# EAGLE design testx2 (EAGLE 7.6.0)

## Sheet 1 of 2
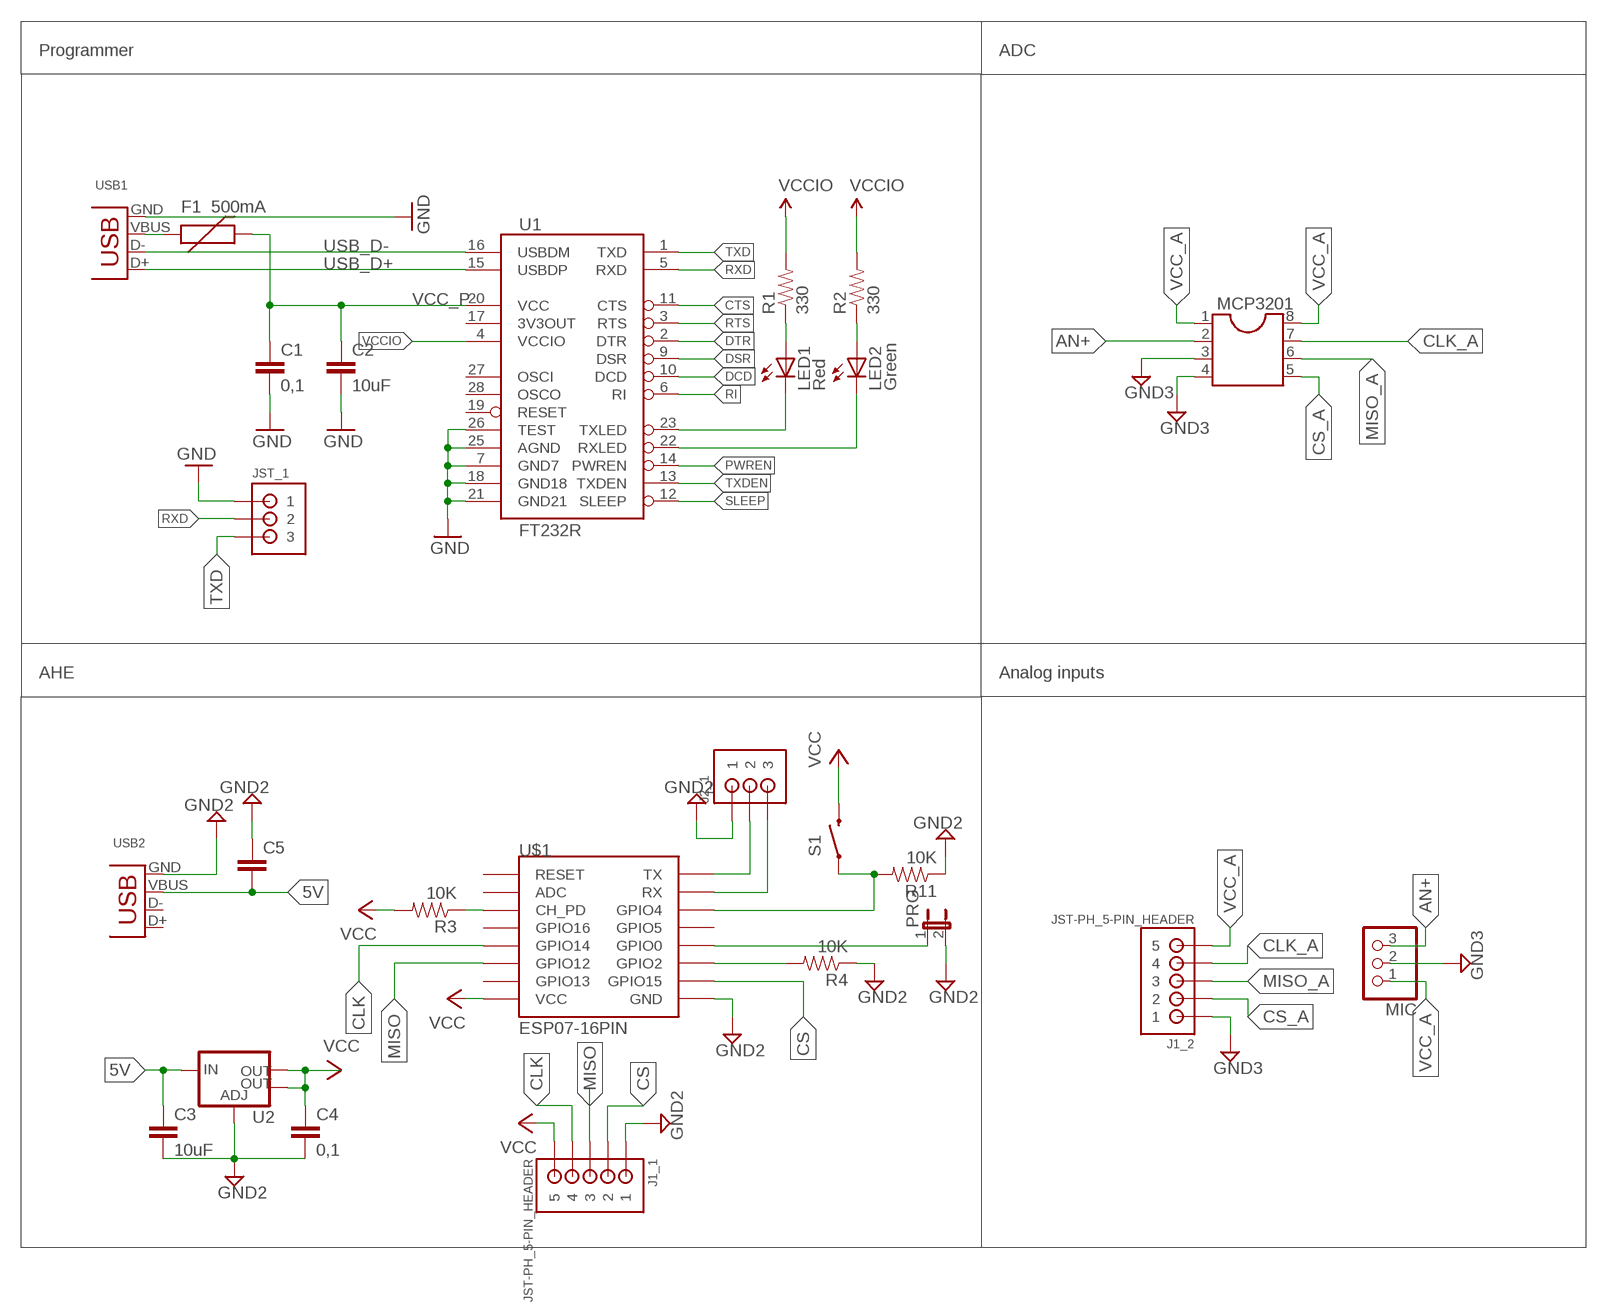
[diagram p0: schematic, sheet 1]

### Parts
C1  0,1  10UF10V10%(0805)  [0805-CAP]
C2  10uF  10UF10V10%(0805)  [0805-CAP]
C3  10uF  10UF10V10%(0805)  [0805-CAP]
C4  0,1  10UF10V10%(0805)  [0805-CAP]
C5  CAP_  [AXIAL-5MM]
F1  500mA  PTCSMD  [PTC-1206]
J1_1  JST-PH_5-PIN_HEADER  [JST_B5B-PH_HEADER]
J1_2  JST-PH_5-PIN_HEADER  [JST_B5B-PH_HEADER]
J2_1  JST-PH_3-PIN_HEADER  [JST_B3B-PH_HEADER]
JST_1  JST-PH_3-PIN_HEADER  [JST_B3B-PH_HEADER]
LED1  Red  LEDSML0805  [SML0805]
LED2  Green  LEDSML0805  [SML0805]
MCP3201  DIL8  [DIL08]
MIC  PINHD-1X03_2.54-S  [1X03-S]
PRG  JP1E  [JP1]
R1  330  0.22OHM-1/4W-1%(0805)  [0805]
R2  330  0.22OHM-1/4W-1%(0805)  [0805]
R3  10K  0.22OHM-1/4W-1%(0805)  [0805]
R4  10K  0.22OHM-1/4W-1%(0805)  [0805]
R11  10K  0.22OHM-1/4W-1%(0805)  [0805]
S1  SWITCH-MOMENTARY-2PTH  [TACTILE-PTH]
U1  FT232R  FT232RLSSOP  [SSOP28DB]
U2  V_REG_LM1117SOT223  [SOT223]
U$1  ESP07-16PIN  [ESP07-16PIN]
USB1  USB-MB-S  [USB-MB-S]
USB2  USB-MB-S  [USB-MB-S]

### Nets
5V: C3.1 C5.P$2 U2.3(IN) USB2.VBUS
AN+: MCP3201.2 MIC.3
CLK: J1_1.P4 U$1.GPIO14
CLK_A: J1_2.P4 MCP3201.7
CS: J1_1.P2 U$1.GPIO15
CS_A: J1_2.P2 MCP3201.5
CTS: U1.11(CTS)
DCD: U1.10(DCD)
DSR: U1.9(DSR)
DTR: U1.2(DTR)
GND [power]: C1.2 C2.2 JST_1.P1 U1.7(GND7) U1.18(GND18) U1.21(GND21) U1.25(AGND) U1.26(TEST) USB1.GND
GND2 [power]: C3.2 C4.2 C5.P$1 J1_1.P1 J2_1.P1 PRG.2 R4.1 R11.1 U2.1(ADJ) U$1.GND USB2.GND
GND3: J1_2.P1 MCP3201.3 MCP3201.4 MIC.2
MISO: J1_1.P3 U$1.GPIO12
MISO_A: J1_2.P3 MCP3201.6
N$1: LED1.A R1.1
N$2: LED2.A R2.1
N$3: F1.1 USB1.VBUS
N$4: R3.1 U$1.CH_PD
N$5: J2_1.P2 U$1.TX
N$6: R4.2 U$1.GPIO2
N$7: PRG.1 U$1.GPIO0
N$8: J2_1.P3 U$1.RX
N$16: R11.2 S1.1 U$1.GPIO4
PWREN: U1.14(PWREN)
RI: U1.6(RI)
RTS: U1.3(RTS)
RXD: JST_1.P2 U1.5(RXD)
RXLED: LED2.C U1.22(RXLED)
SLEEP: U1.12(SLEEP)
TXD: JST_1.P3 U1.1(TXD)
TXDEN: U1.13(TXDEN)
TXLED: LED1.C U1.23(TXLED)
USB_D+: U1.15(USBDP) USB1.D+
USB_D-: U1.16(USBDM) USB1.D-
VCC [power]: C4.1 J1_1.P5 R3.2 S1.3 U2.2(OUT) U2.4(OUT) U$1.VCC
VCC_A [power]: J1_2.P5 MCP3201.1 MCP3201.8 MIC.1
VCC_P [power]: C1.1 C2.1 F1.2 U1.20(VCC)
VCCIO: R1.2 R2.2 U1.4(VCCIO)
Unconnected: U1.17(3V3OUT) U1.19(RESET) U1.27(OSCI) U1.28(OSCO) U$1.ADC U$1.GPIO5 U$1.GPIO13 U$1.GPIO16 U$1.REST(RESET) USB2.D+ USB2.D-

### Notes on the sheet
- Programmer | ADC
- AHE | Analog inputs

## Sheet 2 of 2
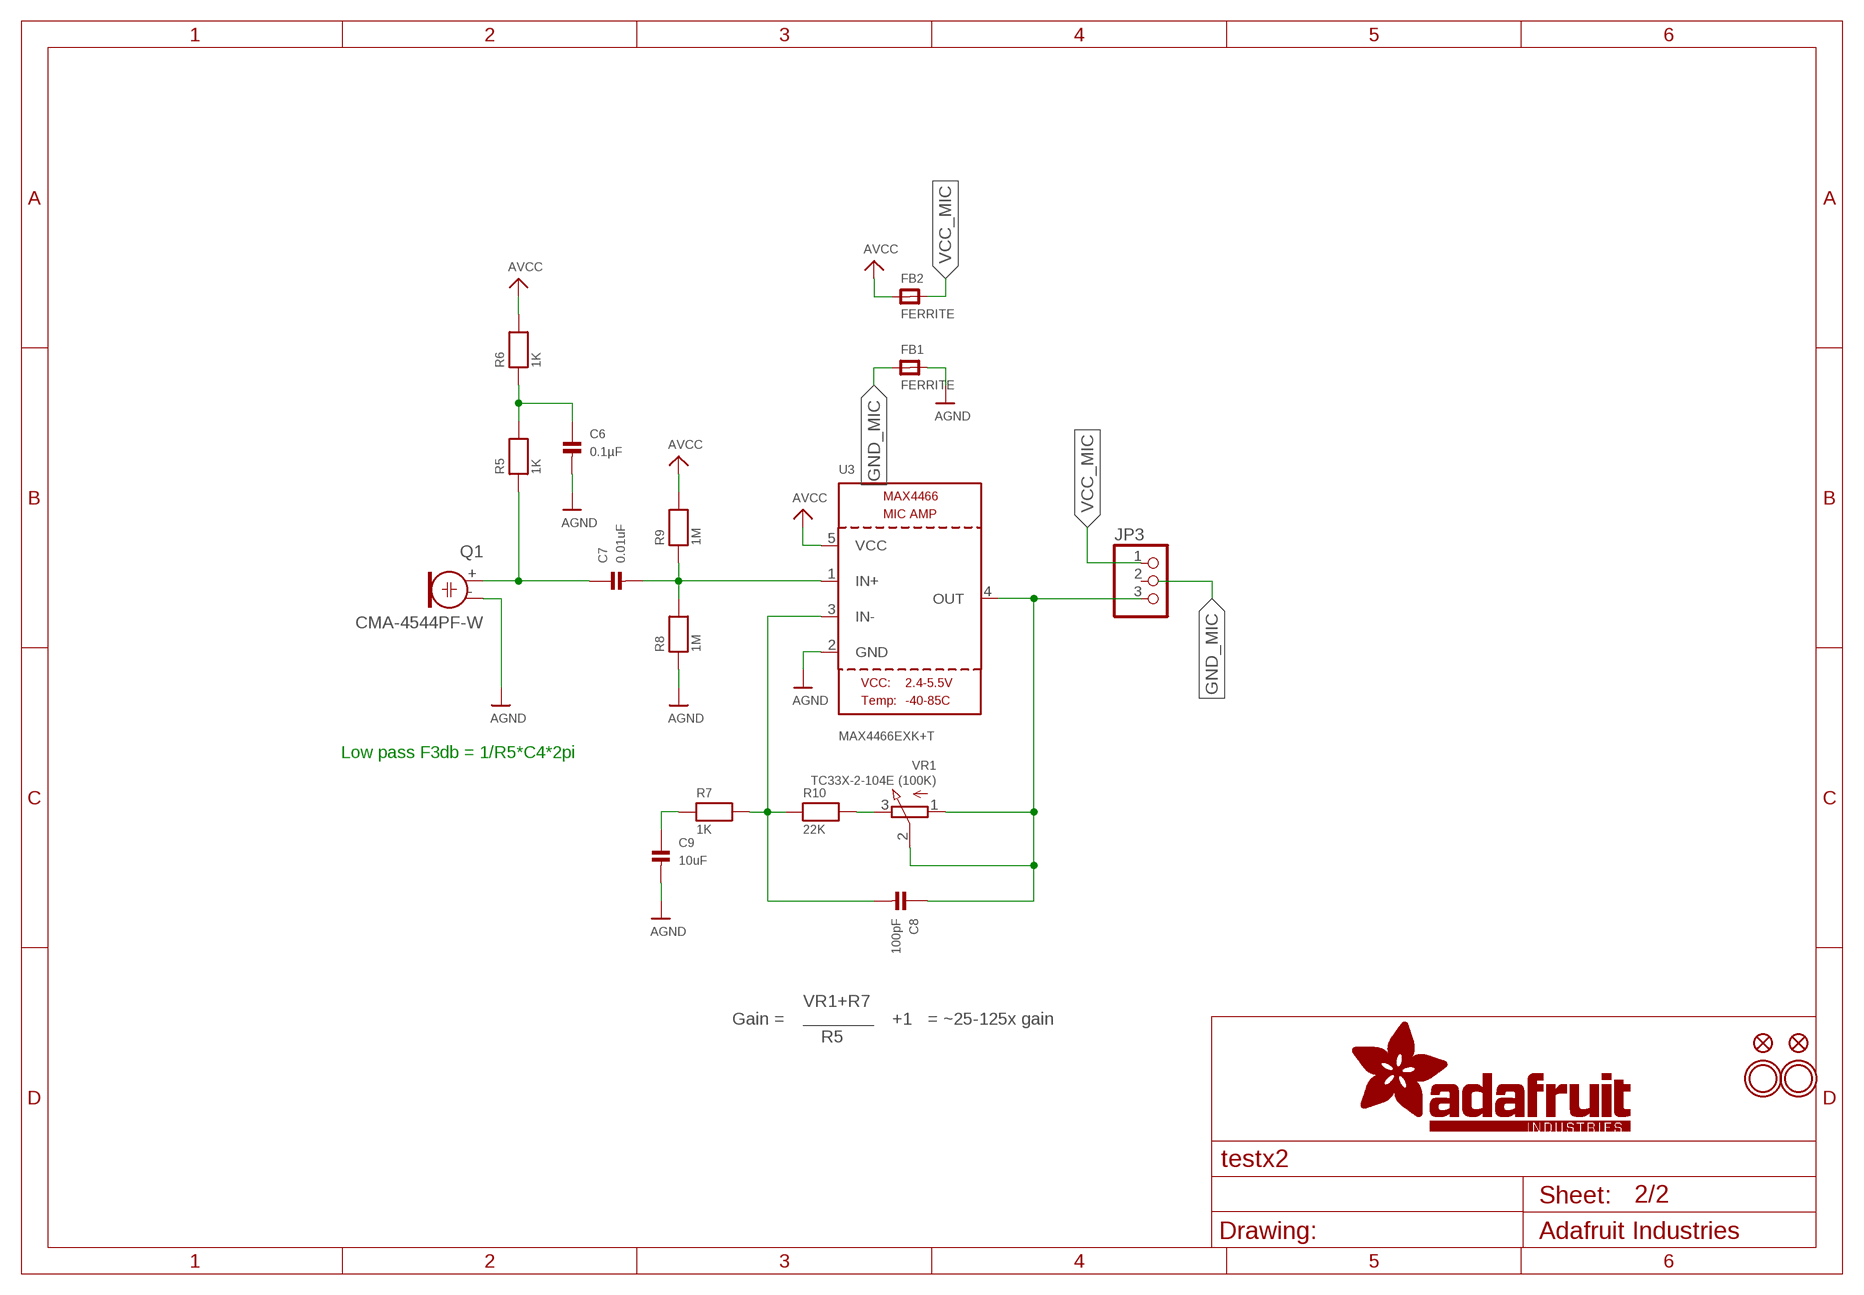
[diagram p1: schematic, sheet 2]

### Parts
C6  0.1µF  CAP_CERAMIC0805  [0805]
C7  0.01uF  CAP_CERAMIC0805  [0805]
C8  100pF  CAP_CERAMIC0805  [0805]
C9  10uF  CAP_CERAMIC0805  [0805]
FB1  FERRITE  FERRITE0805  [0805]
FB2  FERRITE  FERRITE0805  [0805]
FID1  FIDUCIAL""  [FIDUCIAL_1MM]
FID2  FIDUCIAL""  [FIDUCIAL_1MM]
JP3  HEADER-1X376MIL  [1X03_ROUND_76]
Q1  CMA-4544PF-W  ELECTRET  [ELECTRET_9.7]
R5  1K  RESISTOR0805  [0805]
R6  1K  RESISTOR0805  [0805]
R7  1K  RESISTOR0805  [0805]
R8  1M  RESISTOR0805  [0805]
R9  1M  RESISTOR0805  [0805]
R10  22K  RESISTOR0805  [0805]
U3  MAX4466EXK+T  MAX4466""  [SC70-5]
U$16  MOUNTINGHOLE2.5  [MOUNTINGHOLE_2.5_PLATED]
U$17  MOUNTINGHOLE2.5  [MOUNTINGHOLE_2.5_PLATED]
VR1  TC33X-2-104E (100K)  TRIMPOTTC33X-2  [TRIMPOT_BOURNS_TC33X-2]

### Nets
AGND: C6.2 C9.2 FB1.2 Q1.- R8.1 U3.2(GND)
AVCC: FB2.1 R6.2 R9.2 U3.5(VCC)
GND_MIC: FB1.1
N$9: C7.1 Q1.+ R5.1
N$10: C6.1 R5.2 R6.1
N$11: C7.2 R8.2 R9.1 U3.1(IN+)
N$12: C8.1 JP3.3 U3.4(OUT) VR1.1(A) VR1.2(S)
N$13: C8.2 R7.2 R10.1 U3.3(IN-)
N$14: C9.1 R7.1
N$15: R10.2 VR1.3(E)
VCC_MIC [power]: FB2.2 JP3.1
Unconnected: JP3.2

### Notes on the sheet
- Low pass F3db = 1/R5*C4*2pi
- VR1+R7
- Gain = | +1 | = ~25-125x gain
- R5

## Library data of the parts
C1-C4 = SparkFun-Capacitors:10UF10V10%(0805): CAP-11330; PROD_ID: CAP-11330
C5 = SparkFun-Capacitors:CAP: Capacitor Standard 0603 ceramic capacitor, and 0.1" leaded capacitor.
C6-C9 = microbuilder:CAP_CERAMIC: Ceramic Capacitors 0402 - 0402 Surface Mount Capacitors 16pF 50V 5% [Digikey: 445-4899-2-ND] 18pF 50V 5% [Digikey: 490-1281-2-ND] 22pF 50V 5% [Digikey: 490-1283-2-ND] 68pF 50V 5% [Digikey: 490-1289-2-ND] 0.1uF 10V 10% [Digikey: 490-1318-2-ND] 1.0uF 6.3V 10% [Digikey: 490-1320-2-ND] 0603 - 0603 Surface Mount Capacitors 16 pF 50V 5% [Digikey: 445-5051-2-ND] 22 pF 50V [Digikey: PCC220ACVTR-ND] 33 pF 50V 5% [Digikey: 490-1415-1-ND] 56pF 50V 5% [Digikey: 490-1421-1-ND] 220pF 50V 5% [Digikey: 445-1285-1-ND] 680 pF 50V 2200 pF 50V 5% C0G [Digikey: 445-1297-1-ND] 5600 pF 100V 5% X7R [Digikey: 478-3711-1-ND] 0.1 µF 25V 10% [Digikey: PCC2277TR-ND] 0.22 µF 16V 10% X7R [Digikey: 445-1318-1-ND] 1.0 µF 25V 10% [Digikey: 445-5146-2-ND] 0603 - RF Specific 3pF 250V +/-0.1pF RF [Digikey: 712-1347-1-ND] 18 pF 250V 5% [Digikey: 478-3505-1-ND or 712-1322-1-ND] 56 pF 250V 5% C0G RF [Digikey: 490-4867-1-ND] 68 pF 250V RF [Digikey: 490-4868-1-ND] 0805 - 0805 Surface Mount Capacitors 220 pF 250V 2% RF Ceramic Capacitor [Digikey: 712-1398-1-ND] 1000 pF 50V 2% NP0 Ceramic Capacitor [Digikey: 478-3760-1-ND] 0.1 µF 25V 10% Ceramic Capacitor [Digikey: PCC1828TR-ND] 1.0 µF 16V 10% Ceramic Capacitor[Digikey: 490-1691-2-ND] 10.0 µF 10V 10% Ceramic Capacitor[Digikey: 709-1228-1-ND] 10.0 uF 16V 10% Ceramic Capacitor [Digikey: 478-5165-2-ND] 47 uF 6.3V 20% Ceramic Capacitor [Digikey: 587-1779-1-ND or 399-5506-1-ND] 1206 - 1206 Surface Mount Capacitors 47uF 10V 20% Ceramic Capacitor [Digikey: 490-5528-1-ND or 399-5508-1-ND or 445-6010-1-ND] 100uF 6.3V -20%, +80% Y5V Ceramic Capacitor (Digikey: 490-4512-1-ND, Mouser: 81-GRM31CF50J107ZE1L)
F1 = SparkFun:PTC: Resettable Fuse PTC Resettable Fuse. Spark Fun Electronics SKU : COM-08357
FB1 FB2 = microbuilder:FERRITE: Ferrite Bead 0603 MMZ1608B121C - 120 Ohm @ 100MHz, 600mA, 0.15 Ohm DC Resistance - Digikey: 445-2164-1-ND BK1608HW121-T - 120 Ohm, 600mA Ferrite Chip - Digikey: 587-1876-2-ND 0805 HZ0805B272R-10 - 2.7K Ohm @ 100MHz, 200mA, 0.8 Ohm DC Resistance - Digikey: 240-2504-1-ND (see also Murata BLM21BD272SN1L) MMZ2012Y152B - 1.5K Ohm @ 100MHz, 500mA, 0.4 Ohm DC Resistance - Digikey: 445-1560-1-ND - Mainly for high frequency (80-400MHz) MMZ2012R102A - 1K Ohm @ 100MHz, 500mA, 0.3 Ohm DC Resistance - Digikey: 445-1555-2-ND - More general purpose (10-200MHz)
FID1 FID2 = microbuilder:FIDUCIAL: Fiducial Alignment Points Various fiducial points for machine vision alignment.
J1_1 J1_2 = SRG:JST-PH_5-PIN_HEADER: 5-pin JST PH Shrouded Header, top entry P/N B5B-PH-K-S Mating connector PHR-5 Mating cable assembly: Sparkfun PRT-09917 <http://www.sparkfun.com/products/9917>
J2_1 JST_1 = SRG:JST-PH_3-PIN_HEADER: 3-pin JST PH Shrouded Header, top entry P/N B3B-PH-K-S Mating connector PHR-3
JP3 = microbuilder:HEADER-1X3: PIN HEADER
LED1 LED2 = led:LED: LED OSRAM: - CHIPLED LG R971, LG N971, LY N971, LG Q971, LY Q971, LO R971, LY R971 LH N974, LH R974 LS Q976, LO Q976, LY Q976 LO Q996 - Hyper CHIPLED LW Q18S LB Q993, LB Q99A, LB R99A - SideLED LS A670, LO A670, LY A670, LG A670, LP A670 LB A673, LV A673, LT A673, LW A673 LH A674 LY A675 LS A676, LA A676, LO A676, LY A676, LW A676 LS A679, LY A679, LG A679 - Hyper Micro SIDELED® LS Y876, LA Y876, LO Y876, LY Y876 LT Y87S - SmartLED LW L88C, LW L88S LB L89C, LB L89S, LG L890 LS L89K, LO L89K, LY L89K LS L896, LA L896, LO L896, LY L896 - TOPLED LS T670, LO T670, LY T670, LG T670, LP T670 LSG T670, LSP T670, LSY T670, LOP T670, LYG T670 LG T671, LOG T671, LSG T671 LB T673, LV T673, LT T673, LW T673 LH T674 LS T676, LA T676, LO T676, LY T676, LB T676, LH T676, LSB T676, LW T676 LB T67C, LV T67C, LT T67C, LS T67K, LO T67K, LY T67K, LW E67C LS E67B, LA E67B, LO E67B, LY E67B, LB E67C, LV E67C, LT E67C LW T67C LS T679, LY T679, LG T679 LS T770, LO T770, LY T770, LG T770, LP T770 LB T773, LV T773, LT T773, LW T773 LH T774 LS E675, LA E675, LY E675, LS T675 LS T776, LA T776, LO T776, LY T776, LB T776 LHGB T686 LT T68C, LB T68C - Hyper Mini TOPLED® LB M676 - Mini TOPLED Santana® LG M470 LS M47K, LO M47K, LY M47K Source: http://www.osram.convergy.de LUXEON: - LUMILED® LXK2-PW12-R00, LXK2-PW12-S00, LXK2-PW14-U00, LXK2-PW14-V00 LXK2-PM12-R00, LXK2-PM12-S00, LXK2-PM14-U00 LXK2-PE12-Q00, LXK2-PE12-R00, LXK2-PE12-S00, LXK2-PE14-T00, LXK2-PE14-U00 LXK2-PB12-K00, LXK2-PB12-L00, LXK2-PB12-M00, LXK2-PB14-N00, LXK2-PB14-P00, LXK2-PB14-Q00 LXK2-PR12-L00, LXK2-PR12-M00, LXK2-PR14-Q00, LXK2-PR14-R00 LXK2-PD12-Q00, LXK2-PD12-R00, LXK2-PD12-S00 LXK2-PH12-R00, LXK2-PH12-S00 LXK2-PL12-P00, LXK2-PL12-Q00, LXK2-PL12-R00 Source: www.luxeon.com KINGBRIGHT: KA-3528ASYC Source: www.kingbright.com
MCP3201 = ic-package:DIL8: Dual In Line / Socket
MIC = pinhead-2:PINHD-1X03: PIN HEADER
PRG = jumper:JP1E: JUMPER
Q1 = microbuilder:ELECTRET: Electret microphone Thru hole 2.54mm spacing with 9.7mm diameter
R1-R4 R11 = SparkFun-Resistors:0.22OHM-1/4W-1%(0805): RES-09883; PROD_ID: RES-09883; VALUE: 0.22
R5-R10 = microbuilder:RESISTOR: Resistors 0402 - 0402 Surface Mount Package 22 Ohm 1% 1/16W [Digikey: 311-22.0LRTR-ND] 33 Ohm 5% 1/16W 1.0K 5% 1/16W 1.5K 5% 1/16W 2.0K 1% 1/16W 10.0K 1% 1/16W [Digikey: 311-10.0KLRTR-ND] 10.0K 5% 1/16W [Digikey: RMCF0402JT10K0TR-ND] 12.1K 1% 1/16W [Digikey: 311-22.0LRTR-ND] 100.0K 5% 1/16W 0603 - 0603 Surface Mount Package 0 Ohm 1/10 Watt 1% Resistor 15 Ohm 1/10 Watt 1% Resistor 33 Ohm 1/10 Watt 1% Resistor 49.9 Ohm 1/10 Watt 1% Resistor 100 Ohm 1/10 Watt 1% Resistor 150 Ohm 1/10 Watt 1% Resistor 240 Ohm 1/10 Watt 1% Resistor 390 Ohm 1/10 Watt 1% Resistor 560 Ohm 1/10 Watt 1% Resistor 680 Ohm 1/10 Watt 1% Resistor 750 Ohm 1/10 Watt 1% Resistor 1.0K Ohm 1/10 Watt 1% Resistor 1.5K Ohm 1/10 Watt 1% Resistor 2.0K Ohm 1/10 Watt 1% Resistor 2.2K Ohm 1/10 Watt 1% Resistor 3.3K Ohm 1/10 Watt 1% Resistor 4.7K Ohm 1/10 Watt 1% Resistor 10.0K Ohm 1/10 Watt 1% Resistor 12.0K Ohm 1/10 Watt 1% Resistor 12.1K Ohm 1/10 Watt 1% Resistor 20.0K Ohm 1/10 Watt 1% Resistor 33.0K Ohm 1/10 Watt 1% Resistor 100.0K Ohm 1/10 Watt 1% Resistor 0805 - 0805 Surface Mount Package 0 Ohm 1/8 Watt 1% Resistor 33 Ohm 1/8 Watt 1% Resistor 100 Ohm 1/8 Watt 1% Resistor 150 Ohm 1/8 Watt 1% Resistor 200 Ohm 1/8 Watt 1% Resistor 240 Ohm 1/8 Watt 1% Resistor 330 Ohm 1/8 Watt 1% Resistor 390 Ohm 1/8 Watt 1% Resistor 470 Ohm 1/8 Watt 1% Resistor 1.0K Ohm 1/8 Watt 1% Resistor 1.5K Ohm 1/8 Watt 1% Resistor 2.0K Ohm 1/8 Watt 1% Resistor 4.7K Ohm 1/8 Watt 1% Resistor 5.1K Ohm 1/8 Watt 1% Resistor 5.6K Ohm 1/8 Watt 1% Resistor 10.0K Ohm 1/8 Watt 1% Resistor 22.0K Ohm 1/8 Watt 1% Resistor 33.0K Ohm 1/8 Watt 1% Resistor 100K Ohm 1/8 Watt 1% Resistor 1206 - 1206 Surface Mount Package 2012 - 2010 Surface Mount Package 0.11 Ohm 1/2 Watt 1% Resistor - Digikey: RHM.11UCT-ND
S1 = SparkFun-Electromechanical:SWITCH-MOMENTARY-2: Various NO switches- pushbuttons, reed, etc; PROD_ID: SWCH-08441
U1 = SparkFun:FT232RL: USB UART FT232RL 4th Generation USB UART (USB <-> Serial) Controller. Spark Fun Electronics SKU : COM-00650
U2 = SparkFun-PowerIC:V_REG_LM1117: Voltage Regulator LM1117 Standard adjustable voltage regulator but in SMD form. Spark Fun Electronics SKU : COM-00595; PROD_ID: VREG-08170
U3 = microbuilder:MAX4466: MAX4466 - Microphone Pre-Amp
U$1 = esp8266modules:ESP07-16PIN: ESP8266 Wifi module 07 - 16 pins; DIMENSIONS: 22.0 x 16.0 mm; PINS: 16; PITCH: 0.078" / 2 mm
U$16 U$17 = microbuilder:MOUNTINGHOLE: Mounting Hole For #2 screws (0.086"/2.18mm width, 0.094"/2.4mm hole) use 2.5mm
USB1 USB2 = con-usb-3:USB: USB Connectors
VR1 = microbuilder:TRIMPOT: 3-Pin SMT Trimpots Bourns TC33 (X-2) Series 10K - Digikey: TC33X-2-103E 100K - Digikey: TC33X-104ECT-ND Bourns 3303 (W) Series 3mm 10K Single Turn - Digikey: 3303W-103ETR-ND 3mm 100K Single Turn - Digikey: 3303X-104ETR-ND

## Net classes
1 power: width 0.254 mm

## Board
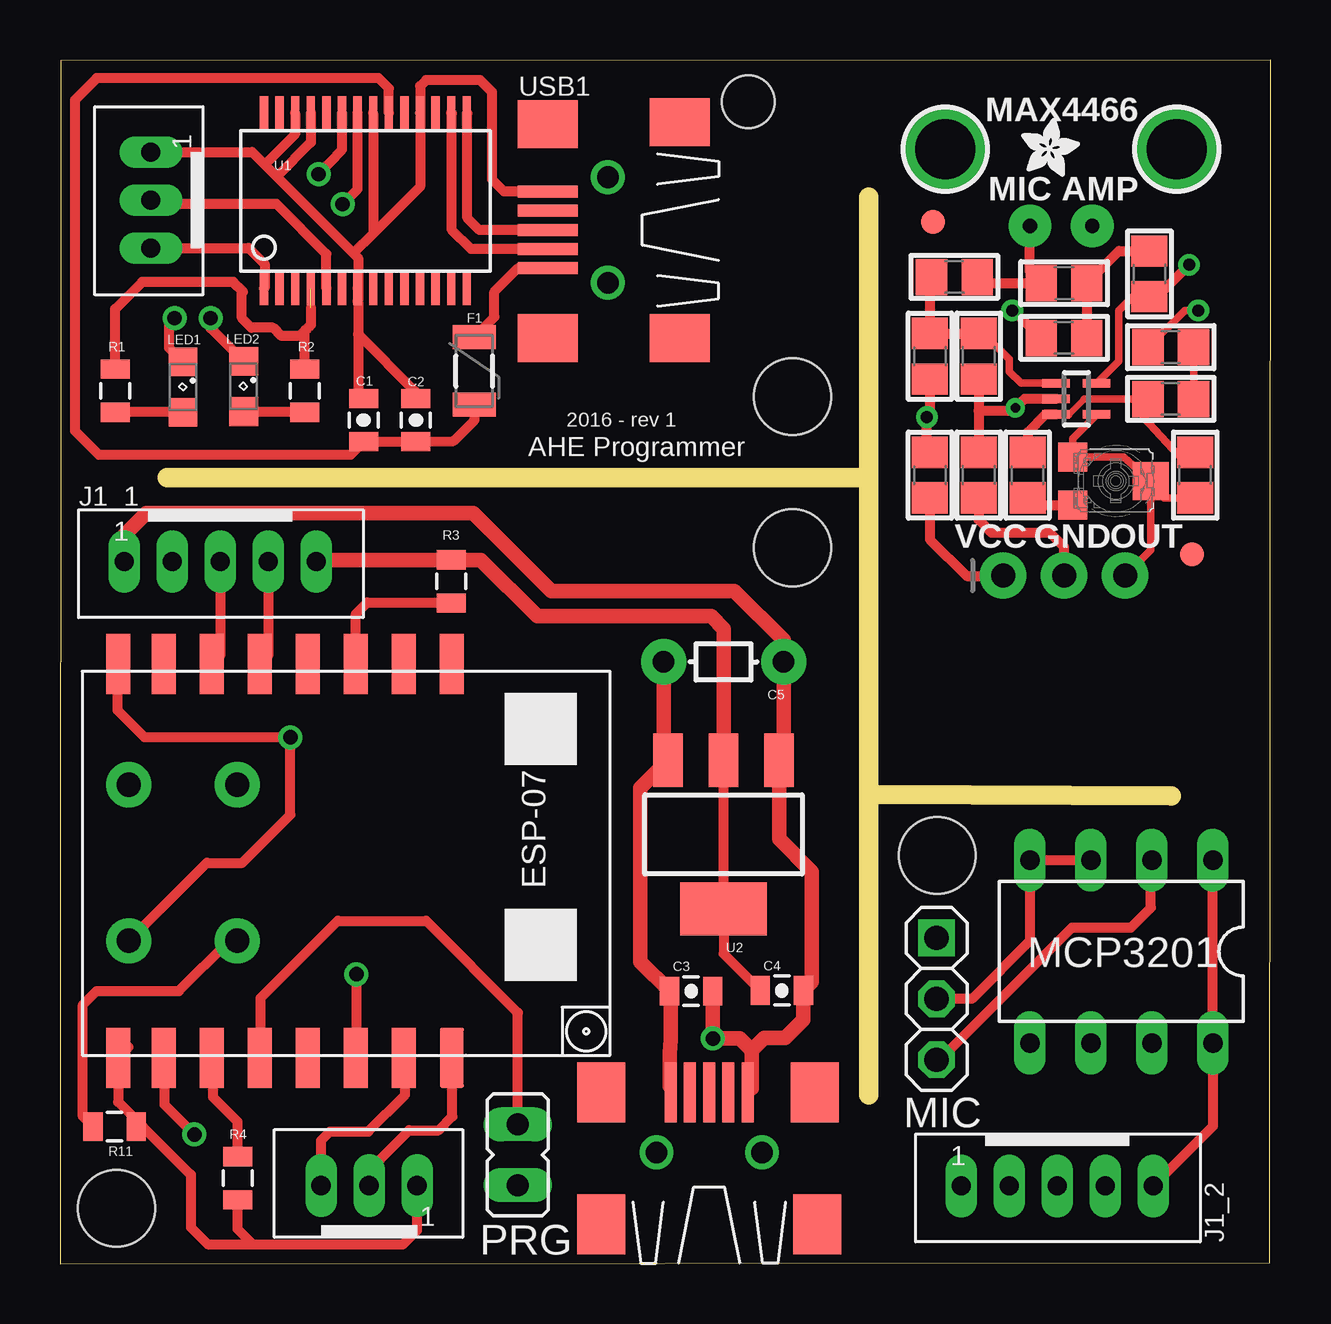
[diagram p2: board, top side]
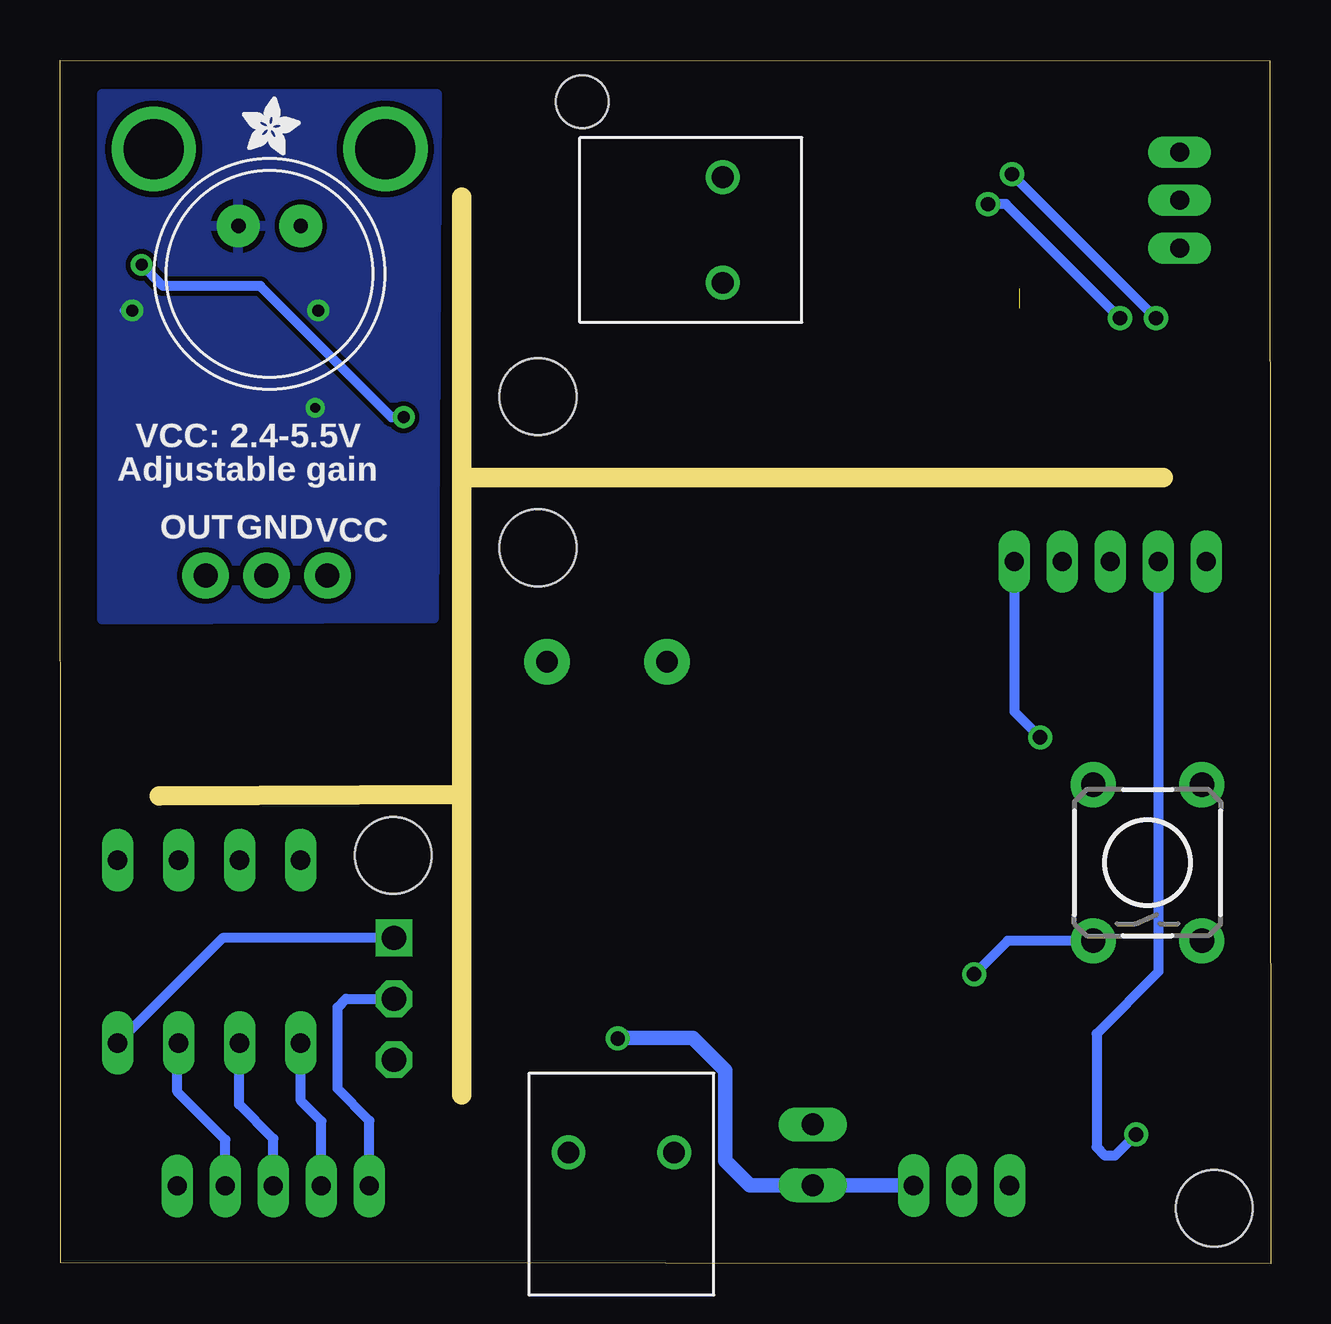
[diagram p3: board, bottom side, seen from below]

Size 50.44 x 50.17 mm. Coordinates in mm from the lower left corner, seen from the top.
Outline: 0,0 50.41,0.02 50.44,50.17 0.03,50.14 0,0
Copper layers (1*16): Top 0.035mm / dielectric 1.5mm / Bottom 0.035mm
Design rules "default": minimum track width 10mil, minimum drill 0.6mm, track to track 8mil, track to pad 8mil, pad to pad 8mil, via to via 8mil, smd to smd 8mil, copper to edge 40mil, drill to drill 8mil, minimum pad ring 10mil, minimum via ring 8mil, stop-mask expansion 4mil, vias tented up to drill 0mil, thermal gap 10mil
Holes 3.2 mm at 30.52,36.13 30.52,29.83 36.55,17.01 2.35,2.31
Holes 2.2 mm at 28.67,48.44
Milling: 3 lines

### Footprints (pad centres in the part's own frame; a part is rotated, then mirrored left to right if it is on the bottom)
0805-CAP = smd 0.8 x 1.2: 1 -0.9,0; 2 0.9,0
AXIAL-5MM = drill 0.9 pad 1.88: P$1 -2.5,0; P$2 2.5,0
0805 = smd 1.3 x 1.5: 1 -0.95,0; 2 0.95,0
PTC-1206 = smd 1 x 1.8: 1 -1.4,0; 2 1.4,0
FIDUCIAL_1MM = smd 1 x 1: 1 0,0
JST_B5B-PH_HEADER = drill 0.8 long: P1 4,0.048; P2 2,0.048; P3 0,0.048; P4 -2,0.048; P5 -4,0.048
JST_B3B-PH_HEADER = drill 0.8 long: P1 2.027,0.048; P2 0.028,0.048; P3 -1.972,0.048
1X03_ROUND_76 = drill 1 pad 1.93: 1 -2.54,0; 2 0,0; 3 2.54,0
SML0805 = smd 1.2 x 1.2: A 1.05,0; C -1.05,0
DIL08 = drill 0.813 long: 1 -3.81,-3.81; 2 -1.27,-3.81; 3 1.27,-3.81; 4 3.81,-3.81; 5 3.81,3.81; 6 1.27,3.81; 7 -1.27,3.81; 8 -3.81,3.81
1X03-S = drill 1.016 square: 1 -2.54,0 | drill 1.016 octagon: 2 0,0; 3 2.54,0
JP1 = drill 0.914 long: 1 0,-1.27; 2 0,1.27
ELECTRET_9.7 = drill 0.6 pad 1.778: + 1.3,2; - -1.3,2
0805' = smd 0.8 x 1.2: 1 -0.9,0; 2 0.9,0
TACTILE-PTH = drill 1.016 pad 1.88: 1 -3.251,2.261; 2 3.251,2.261; 3 -3.251,-2.261; 4 3.251,-2.261
SSOP28DB = smd 0.348 x 1.397: 1 -4.225,-3.656; 2 -3.575,-3.656; 3 -2.925,-3.656; 4 -2.275,-3.656; 5 -1.625,-3.656; 6 -0.975,-3.656; 7 -0.325,-3.656; 8 0.325,-3.656; 9 0.975,-3.656; 10 1.625,-3.656; 11 2.275,-3.656; 12 2.925,-3.656; 13 3.575,-3.656; 14 4.225,-3.656; 15 4.225,3.656; 16 3.575,3.656; 17 2.925,3.656; 18 2.275,3.656; 19 1.625,3.656; 20 0.975,3.656; 21 0.325,3.656; 22 -0.325,3.656; 23 -0.975,3.656; 24 -1.625,3.656; 25 -2.275,3.656; 26 -2.925,3.656; 27 -3.575,3.656; 28 -4.225,3.656
SOT223 = smd 1.219 x 2.235: 1 -2.311,-3.099; 2 0,-3.099; 3 2.311,-3.099 | smd 3.6 x 2.2: 4 0,3.099
SC70-5 = smd 0.35 x 1.15: 1 -0.65,-0.85; 2 0,-0.85; 3 0.65,-0.85; 4 0.65,0.85; 5 -0.65,0.85
ESP07-16PIN = smd 2.5 x 1: ADC -8.2,3.8; CH_PD -8.2,1.8; GND 8.2,-8.105; GPIO0 8.2,-2.2; GPIO2 8.2,-4.2; GPIO4 8.2,1.8; GPIO5 8.2,-0.2; GPIO12 -8.2,-4.2; GPIO13 -8.2,-6.2; GPIO14 -8.2,-2.2; GPIO15 8.2,-6.2; GPIO16 -8.2,-0.2; REST -8.2,5.8; RX 8.2,3.8; TX 8.2,5.8; VCC -8.2,-8.105
MOUNTINGHOLE_2.5_PLATED = drill 2.5 pad 3.2: P$1 0,0
USB-MB-S = smd 2.5 x 0.5: D+ 2.5,0; D- 2.5,0.8; GND 2.5,-1.6; ID 2.5,-0.8; VBUS 2.5,1.6 | smd 2.5 x 2: P$1 -3,-4.5; P$2 -3,4.5; P$3 2.5,-4.4; P$4 2.5,4.5 | drill 0.9: P$5 0,2.2; P$6 0,-2.2
TRIMPOT_BOURNS_TC33X-2 = smd 1.2 x 1.2: 1 -1,-1.8; 3 1,-1.8 | smd 1.6 x 1.5: 2 0,1.45

### Placement (x,y rotation side)
C1  12.65,35.16 90 top
C2  14.83,35.16 90 top
C3  26.3,11.36 0 top
C4  30.07,11.39 0 top
C5  27.65,25.08 180 top
C6  41.84,38.58 180 top
C7  37.27,41.12 180 top
C8  47.3,32.87 90 top
C9  46.28,38.2 180 top
F1  17.25,37.21 270 top
FB1  38.28,32.87 90 top
FB2  36.25,32.87 270 top
FID1  47.17,29.57 0 top
FID2  36.38,43.41 0 top
J1_1  6.68,29.31 180 top
J1_2  41.55,3.29 180 top
J2_1  12.85,3.21 0 top
JP3  41.84,28.68 0 top
JST_1  3.83,44.3 90 top
LED1  5.12,36.53 270 top
LED2  7.65,36.56 270 top
MCP3201  44.23,13.01 180 top
MIC  36.52,11.04 270 top
PRG  19.07,4.54 180 top
Q1  41.71,41.25 0 bottom
R1  330  [0805']  2.3,36.38 90 top
R2  330  [0805']  10.2,36.38 90 top
R3  10K  [0805']  16.3,28.43 90 top
R4  10K  [0805']  7.4,3.56 90 top
R5  41.84,40.87 0 top
R6  45.39,41.25 270 top
R7  46.28,36.05 180 top
R8  38.28,37.82 90 top
R9  36.25,37.82 270 top
R10  40.31,32.87 270 top
R11  10K  [0805']  2.27,5.71 180 top
S1  5.12,16.71 90 bottom
U1  12.72,44.3 0 top
U2  27.65,17.89 180 top
U3  42.34,36.05 270 top
U$1  10.53,16.79 270 top
U$16  36.88,46.46 0 top
U$17  46.54,46.46 0 top
U$19  [ADAFRUIT_2.5MM]  40.06,45.32 0 top
U$20  [ADAFRUIT_2.5MM]  42.85,46.2 0 bottom
USB1  22.82,43.08 180 top
USB2  27.05,4.64 90 top
VR1  44,32.62 270 top

### Tracks (layer width: path | path; a pad name or v marks a point on that pad's centre or on a via)
5V
  Top 0.406: 25.15,21.17 U2.3 | C3.1 25.45,11.31 | 25.4,7.39 USB2.VBUS
  Top 0.61: C3.1 24.17,12.58 24.17,19.82 U2.3 | 25.15,21.17 C5.P$2 | 25.45,11.31 25.45,9.33 25.4,8.79 25.4,7.39
AGND  (via drill 0.4, 0.5)
  Top 0.305: C9.2 46.86,39.73 v47.42,39.73
  Top 0.406: 38.53,33.82 FB1.2 38.28,35.54 | U3.2 40.19,36.05 v39.8,35.66 39.68,35.54 38.28,35.54 | C6.2 39.74,39.73 v39.68,39.73 | R8.1 38.28,35.54
  Bottom 0.305: v47.42,39.73 47.81,39.73
  Bottom 0.406: v39.68,39.73 39.68,39.98
  pour Bottom: 34.73,48.74 48.7,48.74 48.7,26.86 34.85,26.9
AN+
  Top 0.406: MIC.3 36.66,8.5 42.17,14.01 44.62,14.01 45.45,14.83 45.45,16.78 MCP3201.2
AVCC  (via drill 0.5)
  Top 0.305: U3.5 44.12,37.62 44.12,39.73 44.7,40.3 R6.2
  Top 0.406: R9.2 36.25,35.41 v36.12,35.28 36.12,33.57 FB2.1 | v47.04,41.63 45.71,40.3 R6.2
  Bottom 0.406: v36.12,35.28 36.63,35.28 42.09,40.74 46.16,40.74 v47.04,41.63
CLK
  Top 0.406: J1_1.P4 8.68,25.33 U$1.GPIO14
CLK_A
  Bottom 0.406: J1_2.P4 43.55,5.16 45.55,7.16 45.55,9.14 MCP3201.7
CS  (via drill 0.6)
  Top 0.406: U$1.GPIO15 4.35,7.74 4.35,6.64 v5.6,5.39
  Bottom 0.406: J1_1.P2 4.68,12.16 7.25,9.58 7.25,4.86 6.9,4.51 6.48,4.51 v5.6,5.39
CS_A
  Bottom 0.406: J1_2.P2 39.55,5.93 40.4,6.79 40.4,9.18 MCP3201.5
GND
  Top 0.406: U1.7 12.4,40.11 | JST_1.P1 8.01,46.33 8.53,45.81 | 8.53,45.81 9.03,45.31 | 9.03,45.31 12.22,42.11 | 12.22,42.11 12.43,41.91 12.43,40.13 12.4,40.11 | U1.26 9.8,47.08 8.53,45.81 | U1.25 10.45,46.73 9.03,45.31 | U1.21 13.05,42.94 | 13.05,42.94 12.22,42.11 | 13.05,42.94 15,44.88 U1.18 15,49.08 15.25,49.33 17.5,49.33 18,48.83 18,45.19 18.5,44.69 USB1.GND | 12.4,40.11 12.43,40.08 12.43,38.73 | 12.43,38.73 12.43,36.28 C1.2 | C2.2 14.83,36.33 12.43,38.73
GND2  (via drill 0.6)
  Top 0.406: J2_1.P1 14.88,1.39 14.28,0.79 8.05,0.79 8.03,0.81 | 28.82,7.31 USB2.GND | 8.03,0.81 7.4,1.43 R4.1 | 8.03,0.81 6.15,0.81 5.45,1.51 5.45,3.71 3.45,5.71 R11.1 3.17,5.99 2.42,6.74 U$1.GND 2.86,9.03
  Top 0.61: J1_1.P1 2.67,30.36 3.6,31.29 17.22,31.29 20.47,28.04 28.1,28.04 30.15,25.99 C5.P$1 30.15,21.17 U2.1 29.96,17.7 31.32,16.33 31.32,11.74 C4.2 30.97,10.16 30.22,9.41 29.35,9.41 28.82,8.89 | 28.82,8.89 28.32,9.39 v27.2,9.39 C3.2 | 28.82,8.89 28.82,7.31
  Bottom 0.406: J2_1.P1
  Bottom 0.61: J2_1.P1 PRG.2 21.7,3.27 22.72,4.29 22.72,8.06 24.07,9.41 27.17,9.41 v27.2,9.39
GND3
  Top 0.406: MCP3201.3 MCP3201.4 40.41,13.45 38,11.04 MIC.2
  Bottom 0.406: J1_2.P1 37.55,5.96 38.88,7.29 38.88,10.68 38.52,11.04 MIC.2
GND_MIC
  Top 0.406: FB1.1 38.28,31 38.82,30.46 41.25,30.46 41.82,29.89 41.82,28.69
MISO
  Top 0.406: J1_1.P3 6.68,25.33 U$1.GPIO12
MISO_A
  Bottom 0.406: J1_2.P3 41.55,5.21 42.98,6.64 42.98,9.18 MCP3201.6
N$1
  Top 0.406: LED1.A R1.1
N$2
  Top 0.406: R2.1 7.68,35.48 LED2.A
N$3
  Top 0.406: F1.1 18.1,39.45 18.1,40.51 19.07,41.48 USB1.VBUS
N$4
  Top 0.406: U$1.CH_PD 12.33,27.08 12.8,27.56 16.27,27.56 R3.1
N$5
  Top 0.406: J2_1.P2 12.88,3.89 14.55,5.56 15.78,5.56 16.35,6.14 16.35,7.74 U$1.TX
N$6
  Top 0.406: U$1.GPIO2 6.4,7.68 6.38,7.66 6.38,6.93 7.4,5.91 R4.2
N$7
  Top 0.406: U$1.GPIO0 8.35,8.61 8.35,11.06 11.58,14.29 15.25,14.29 19.07,10.46 PRG.1
N$8
  Top 0.406: J2_1.P3 10.88,5.14 11.25,5.51 12.85,5.51 14.38,7.04 14.38,7.71 U$1.RX
N$9
  Top 0.406: Q1.+ 40.41,41.35 R5.1 38.47,40.87 C7.1
N$10
  Top 0.406: C6.1 R5.2 44.12,42.2 R6.1
N$11
  Top 0.305: 38.73,38.77 R8.2 38.47,38.77 39.55,37.7 39.55,37.19 40.04,36.69 U3.1
  Top 0.406: R8.2 R9.1 36.25,41.06 C7.2
N$12
  Top 0.305: U3.4 42.2,34.4 VR1.1 44.32,33.62 VR1.2 | VR1.2 46.02,31.92 C8.1 | JP3.3 45.45,29.75 VR1.2
N$13
  Top 0.254: 42.02,35.39 42.67,36.05
  Top 0.305: U3.3 42.02,35.39 | 42.67,36.05 R7.2 | C8.2 46.6,33.69 45.14,35.28 45.14,35.98
  Top 0.406: U3.3 41.06,35.39 40.31,34.65 R10.1 | 45.14,35.98 45.2,36.05 R7.2
N$14
  Top 0.305: C9.1 R7.1
N$15
  Top 0.406: R10.2 40.36,31.62 VR1.3
N$16  (via drill 0.6)
  Top 0.406: v12.35,12.06 12.35,8.61 U$1.GPIO4 | R11.2 0.95,6.14 0.95,10.79 1.52,11.36 4.95,11.36 7.05,13.46 S1.1
  Bottom 0.406: S1.1 10.95,13.46 v12.35,12.06
RXD
  Top 0.406: U1.5 11.1,42.08 9.03,44.16 3.96,44.16 JST_1.P2
RXLED  (via drill 0.6)
  Top 0.406: v11.78,44.16 12.4,44.78 U1.22 | v6.27,39.4 v6.28,39.41 6.28,38.98 LED2.C
  Bottom 0.406: v6.28,39.41 11.03,44.16 v11.78,44.16
TXD
  Top 0.406: JST_1.P3 7.86,42.33 8.53,41.66 8.53,40.67 U1.1
TXLED  (via drill 0.6)
  Top 0.406: v10.78,45.41 11.75,46.44 U1.23 | v4.78,39.41 4.54,39.17 4.54,38.17 LED1.C
  Bottom 0.406: v4.78,39.41 v10.78,45.41
USB_D+
  Top 0.406: USB1.D+ 17.47,43.08 16.97,43.58 16.97,47.93 U1.15
USB_D-
  Top 0.406: USB1.D- 17.12,42.28 16.32,43.08 16.32,47.93 U1.16
VCC  (via drill 0.6)
  Top 0.406: U$1.VCC 2.4,24.96 2.4,23.06 3.52,21.93 v9.6,21.93 9.6,18.71 7.6,16.71 6.12,16.71 S1.3 | C4.1 27.65,12.91 U2.4 U2.2
  Top 0.61: J1_1.P5 10.75,29.33 R3.2 17.52,29.33 19.88,26.99 27.12,26.99 27.65,26.46 U2.2
  Bottom 0.406: J1_1.P5 10.68,23.01 v9.6,21.93
VCC_A
  Top 0.406: J1_2.P5 48.03,5.72 MCP3201.8 MCP3201.1
  Bottom 0.406: MIC.1 43.66,13.57 MCP3201.8
VCC_MIC
  Top 0.406: FB2.2 36.25,30.19 37.77,28.66 39.28,28.66 JP3.1
VCC_P
  Top 0.406: U1.20 13.7,48.98 13.28,49.41 1.52,49.41 0.62,48.51 0.62,34.71 1.62,33.71 12.1,33.71 C1.1 C2.1 16.4,34.28 17.27,35.16 17.27,35.79 F1.2
VCCIO  (1 unrouted)
  Top 0.406: R1.2 2.3,39.78 3.42,40.91 7.23,40.91 7.62,40.51 7.58,40.46 7.58,39.41 7.98,39.01 8.88,39.01 9.22,38.66 9.97,38.66 10.2,38.88 | 10.45,39.83 10.45,39.13 10.34,39.02 10.2,38.88 | R2.2 10.2,38.88

### Text on the board
tPlace: MAX4466 | MIC AMP | 2016 - rev 1 | AHE Programmer | VCC | GND | OUT
bPlace: VCC: 2.4-5.5V | Adjustable gain | VCC | GND | OUT